# Altium schematic sheet Debugger.SchDoc: =DocumentName
size A4; Organization: Queen's Formula SAE; Address1: 130 Stuart St, Kingston; Address2: Ontario; Address3: Canada; Address4: K7L 2V9; DocumentNumber: 1; Revision: 0; SheetNumber: 1; SheetTotal: 1
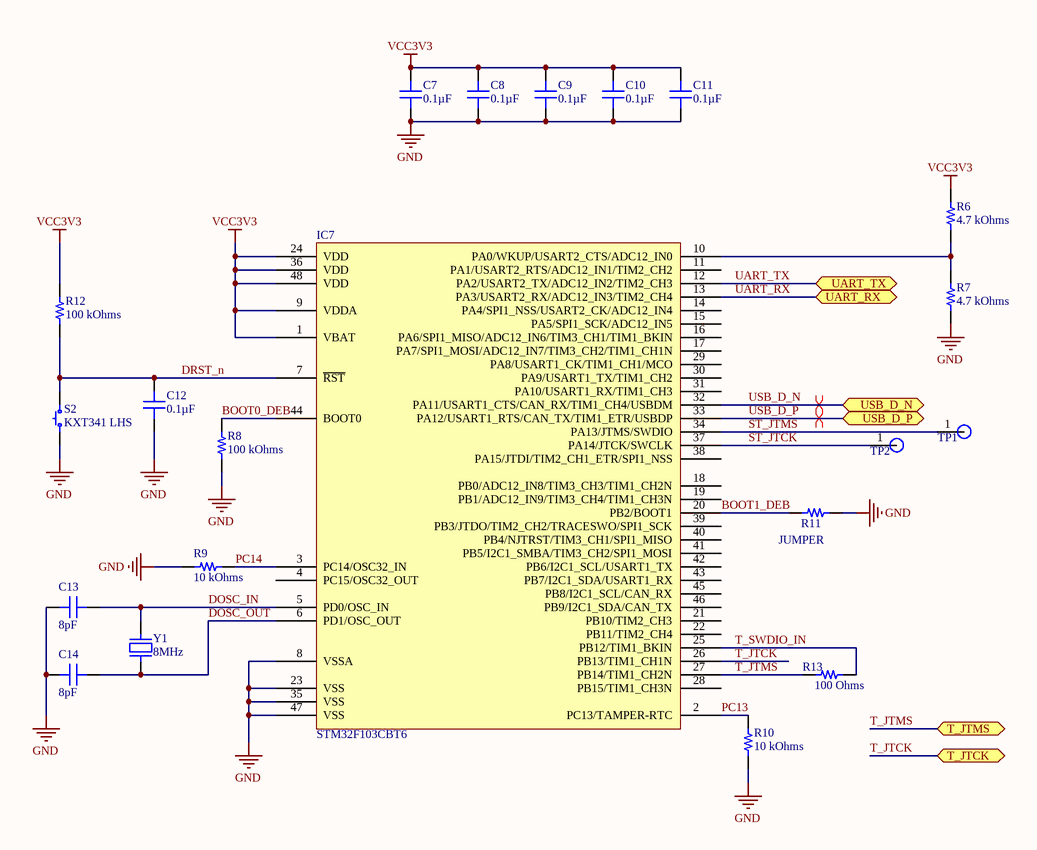
[diagram p0: Debugger.SchDoc]

## Parts
C7  0.1µF  [CAP 0201_0603]
C8  0.1µF  [CAP 0201_0603]
C9  0.1µF  [CAP 0201_0603]
C10  0.1µF  [CAP 0201_0603]
C11  0.1µF  [CAP 0201_0603]
C12  0.1µF  [CAP 0201_0603]
C13  8pF  [CAP 0402_1005]
C14  8pF  [CAP 0402_1005]
IC7  STM32F103CBT6  [ST LQFP-48 7X7MM]
R6  4.7 kOhms  [RES 0201_0603]
R7  4.7 kOhms  [RES 0201_0603]
R8  100 kOhms  [RES 0402_1005]
R9  10 kOhms  [RES 0201_0603]
R10  10 kOhms  [RES 0201_0603]
R11  JUMPER  [RES 0402_1005]
R12  100 kOhms  [RES 0201_0603]
R13  100 Ohms  [RES 0201_0603]
S2  KXT341 LHS  [C&K KXT3]
TP1  Test Point  [TP1]  (value not drawn)  (no BOM)
TP2  Test Point  [TP1]  (value not drawn)  (no BOM)
Y1  8MHz  [NDK NX3225GD]

## Ports
T_JTCK (bidir), T_JTMS (bidir), UART_RX (bidir), UART_TX (bidir), USB_D_N (bidir), USB_D_P (bidir)

## Nets
GND: C7.1 C8.1 C9.1 C10.1 C11.1 C12.1 C13.1 C14.1 IC7.8(VSSA) IC7.23(VSS) IC7.35(VSS) IC7.47(VSS) R7.1 R8.1 R9.2 R10.1 R11.1 S2.1
VCC3V3: C7.2 C8.2 C9.2 C10.2 C11.2 IC7.1(VBAT) IC7.9(VDDA) IC7.24(VDD) IC7.36(VDD) IC7.48(VDD) R6.2 R12.2
BOOT0_DEB: IC7.44(BOOT0) R8.2
BOOT1_DEB: IC7.20(PB2/BOOT1) R11.2
DOSC_IN: C13.2 IC7.5(PD0/OSC_IN) Y1.2
DOSC_OUT: C14.2 IC7.6(PD1/OSC_OUT) Y1.1
DRST_n: C12.2 IC7.7(~{RST}) R12.1 S2.2
PC13: IC7.2(PC13/TAMPER-RTC) R10.2
PC14: IC7.3(PC14/OSC32_IN) R9.1
ST_JTCK: IC7.37(PA14/JTCK/SWCLK) TP2.1
ST_JTMS: IC7.34(PA13/JTMS/SWDIO) TP1.1
T_JTCK: IC7.26(PB13/TIM1_CH1N) ; port T_JTCK
T_JTMS: IC7.27(PB14/TIM1_CH2N) R13.1 ; port T_JTMS
T_SWDIO_IN: IC7.25(PB12/TIM1_BKIN) R13.2
UART_RX: IC7.13(PA3/USART2_RX/ADC12_IN3/TIM2_CH4) ; port UART_RX
UART_TX: IC7.12(PA2/USART2_TX/ADC12_IN2/TIM2_CH3) ; port UART_TX
USB_D_N: IC7.32(PA11/USART1_CTS/CAN_RX/TIM1_CH4/USBDM) ; port USB_D_N
USB_D_P: IC7.33(PA12/USART1_RTS/CAN_TX/TIM1_ETR/USBDP) ; port USB_D_P
NetIC7_10: IC7.10(PA0/WKUP/USART2_CTS/ADC12_IN0) R6.1 R7.2

Not connected (* = marked no-connect by the designer): IC7 4(PC15/OSC32_OUT) 11(PA1/USART2_RTS/ADC12_IN1/TIM2_CH2) 14(PA4/SPI1_NSS/USART2_CK/ADC12_IN4) 15(PA5/SPI1_SCK/ADC12_IN5) 16(PA6/SPI1_MISO/ADC12_IN6/TIM3_CH1/TIM1_BKIN) 17(PA7/SPI1_MOSI/ADC12_IN7/TIM3_CH2/TIM1_CH1N) 18(PB0/ADC12_IN8/TIM3_CH3/TIM1_CH2N) 19(PB1/ADC12_IN9/TIM3_CH4/TIM1_CH3N) 21(PB10/TIM2_CH3) 22(PB11/TIM2_CH4) 28(PB15/TIM1_CH3N) 29(PA8/USART1_CK/TIM1_CH1/MCO) 30(PA9/USART1_TX/TIM1_CH2) 31(PA10/USART1_RX/TIM1_CH3) 38(PA15/JTDI/TIM2_CH1_ETR/SPI1_NSS) 39(PB3/JTDO/TIM2_CH2/TRACESWO/SPI1_SCK) 40(PB4/NJTRST/TIM3_CH1/SPI1_MISO) 41(PB5/I2C1_SMBA/TIM3_CH2/SPI1_MOSI) 42(PB6/I2C1_SCL/USART1_TX) 43(PB7/I2C1_SDA/USART1_RX) 45(PB8/I2C1_SCL/CAN_RX) 46(PB9/I2C1_SDA/CAN_TX)

## Layout directives
differential pair: USB_D_N, USB_D_P

## Notes on the sheet
- Title
- Size:
- Date:
- A4
- Number:
- Time:
- Revision:
- Sheet
- of
- File:

## Library data of the parts
C7-C12 = EMK063BJ104KP-F: CAP CER 0.1UF 16V X5R 0201; Manufacturer: Taiyo Yuden; Tolerance: ±10%; Part Number: EMK063BJ104KP-F; Value: 0.1µF; Applications: General Purpose; Capacitance: 0.1µF; ComponentLink1Description: Datasheet; ComponentLink1URL: https://ds.yuden.co.jp/TYCOMPAS/ut/detail?pn=EMK063BJ104KP-F  &u=M; ComponentLink2Description: DigiKey Link; ComponentLink2URL: http://digikey.com/product-detail/en/taiyo-yuden/EMK063BJ104KP-F/587-5833-1-ND/7674954; Device Package: 0201 (0603 Metric); LastUpdated: 2020-09-02 1:00:18 AM; Lifecycle Status: Active; Minimum Order: 1; Mounting Type: Surface Mount, MLCC; Operating Temperature: -55°C ~ 85°C; Package / Case: 0201 (0603 Metric); Packaging: TapeAndReel; PartId: 12; Part Status: Active; Price: 0.02; Series: M; Size / Dimension: 0.024" L x 0.012" W (0.60mm x 0.30mm); Supplier 1: DigiKey; Supplier Part Number 1: 587-5833-1-ND; Temperature Coefficient: X5R; Thickness (Max): 0.013" (0.33mm); Voltage - Rated: 16V
C13 C14 = C1005NP01H080D050BA: CAP CER 8PF 50V NP0 0402; Manufacturer: TDK Corporation; Temperature Coefficient: C0G, NP0; Tolerance: ±0.5pF; Part Number: C1005NP01H080D050BA; Value: 8pF; Applications: General Purpose; Capacitance: 8pF; ComponentLink1Description: Datasheet; ComponentLink1URL: https://product.tdk.com/info/en/catalog/datasheets/mlcc_commercial_hightemp_en.pdf?ref_disty=digikey; ComponentLink2Description: DigiKey Link; ComponentLink2URL: http://digikey.com/product-detail/en/tdk-corporation/C1005NP01H080D050BA/445-13781-1-ND/3955447; Device Package: 0402 (1005 Metric); Features: High Temperature; LastUpdated: 2020-09-02 1:02:24 AM; Lifecycle Status: Active; Minimum Order: 1; Mounting Type: Surface Mount, MLCC; Operating Temperature: -55°C ~ 150°C; Package / Case: 0402 (1005 Metric); Packaging: TapeAndReel; PartId: 2033; Part Status: Active; Price: 0.01; Series: C; Size / Dimension: 0.039" L x 0.020" W (1.00mm x 0.50mm); Supplier 1: DigiKey; Supplier Part Number 1: 445-13781-1-ND; Thickness (Max): 0.022" (0.55mm); Voltage - Rated: 50V
IC7 = STM32F103CBT6: IC MCU 32BIT 128KB FLASH 48LQFP; Manufacturer: STMicroelectronics; Connectivity: CANbus, I²C, IrDA, LINbus, SPI, UART/USART, USB; Core Processor: ARM® Cortex®-M3; Core Size: 32-Bit; Data Converters: A/D 10x12b; Number of I/O: 37; Oscillator Type: Internal; Peripherals: DMA, Motor Control PWM, PDR, POR, PVD, PWM, Temp Sensor, WDT; Program Memory Size: 128KB (128K x 8); RAM Size: 20K x 8; Speed: 72MHz; Voltage - Supply (Vcc/Vdd): 2V ~ 3.6V; Part Number: STM32F103CBT6; ComponentLink1Description: Datasheet; ComponentLink1URL: https://www.st.com/resource/en/datasheet/stm32f103cb.pdf; ComponentLink2Description: DigiKey Link; ComponentLink2URL: http://digikey.com/product-detail/en/stmicroelectronics/STM32F103CBT6/497-6288-ND/1754420; Device Package: 48-LQFP; LastUpdated: 2020-05-24 10:49:18 PM; Lifecycle Status: Active; Minimum Order: 1; Mounting Type: Surface Mount; Operating Temperature: -40°C ~ 85°C (TA); Package / Case: 48-LQFP; Packaging: Tray; PartId: 194; Part Status: Active; Price: 5.25; Program Memory Type: FLASH; Series: STM32F1; Supplier 1: DigiKey; Supplier Part Number 1: 497-6288-ND
R6 R7 = CRCW02014K70FKED: RES SMD 4.7K OHM 1% 1/20W 0201; Manufacturer: Vishay Dale; Power (Watts): 0.05W, 1/20W; Temperature Coefficient: ±100ppm/°C; Part Number: CRCW02014K70FKED; Value: 4.7 kOhms; ComponentLink1Description: Datasheet; ComponentLink1URL: http://www.vishay.com/docs/20052/crcw0201e3.pdf; ComponentLink2Description: DigiKey Link; ComponentLink2URL: http://digikey.com/product-detail/en/vishay-dale/CRCW02014K70FKED/541-4.70KAABCT-ND/1968253; Composition: Thick Film; Device Package: 0201 (0603 Metric); Height - Seated (Max): 0.011" (0.28mm); LastUpdated: 2020-09-02 1:06:25 AM; Lifecycle Status: Active; Minimum Order: 1; Number of Terminations: 2; Operating Temperature: -55°C ~ 155°C; Package / Case: 0201 (0603 Metric); Packaging: TapeAndReel; PartId: 37; Part Status: Active; Price: 0.03; Resistance: 4.7 kOhms; Series: CRCW; Size / Dimension: 0.024" L x 0.012" W (0.60mm x 0.30mm); Supplier 1: DigiKey; Supplier Part Number 1: 541-4.70KAABCT-ND; Supplier Device Package: 0201; Tolerance: ±1%
R8 = AC0402FR-07100KL: RES SMD 100K OHM 1% 1/16W 0402; Manufacturer: Yageo; Power (Watts): 0.063W, 1/16W; Temperature Coefficient: ±100ppm/°C; Part Number: AC0402FR-07100KL; Value: 100 kOhms; ComponentLink1Description: Datasheet; ComponentLink1URL: https://www.yageo.com/upload/media/product/productsearch/datasheet/rchip/PYu-AC_51_RoHS_L_7.pdf; ComponentLink2Description: DigiKey Link; ComponentLink2URL: http://digikey.com/product-detail/en/yageo/AC0402FR-07100KL/YAG3434CT-ND/6006283; Composition: Thick Film; Device Package: 0402 (1005 Metric); Features: Automotive AEC-Q200, Moisture Resistant; Height - Seated (Max): 0.015" (0.37mm); LastUpdated: 2020-09-02 1:07:50 AM; Lifecycle Status: Active; Minimum Order: 1; Number of Terminations: 2; Operating Temperature: -55°C ~ 155°C; Package / Case: 0402 (1005 Metric); Packaging: CutTape; PartId: 12047; Part Status: Active; Price: 0.10; Ratings: AEC-Q200; Resistance: 100 kOhms; Series: AC; Size / Dimension: 0.039" L x 0.020" W (1.00mm x 0.50mm); Supplier 1: DigiKey; Supplier Part Number 1: YAG3434CT-ND; Supplier Device Package: 0402; Tolerance: ±1%
R9 R10 = CRCW020110K0FKED: RES SMD 10K OHM 1% 1/20W 0201; Manufacturer: Vishay Dale; Power (Watts): 0.05W, 1/20W; Temperature Coefficient: ±100ppm/°C; Part Number: CRCW020110K0FKED; Value: 10 kOhms; ComponentLink1Description: Datasheet; ComponentLink1URL: http://www.vishay.com/docs/20052/crcw0201e3.pdf; ComponentLink2Description: DigiKey Link; ComponentLink2URL: http://digikey.com/product-detail/en/vishay-dale/CRCW020110K0FKED/541-10.0KAABCT-ND/1968173; Composition: Thick Film; Device Package: 0201 (0603 Metric); Height - Seated (Max): 0.011" (0.28mm); LastUpdated: 2020-09-02 1:06:25 AM; Lifecycle Status: Active; Minimum Order: 1; Number of Terminations: 2; Operating Temperature: -55°C ~ 155°C; Package / Case: 0201 (0603 Metric); Packaging: TapeAndReel; PartId: 29; Part Status: Active; Price: 0.03; Resistance: 10 kOhms; Series: CRCW; Size / Dimension: 0.024" L x 0.012" W (0.60mm x 0.30mm); Supplier 1: DigiKey; Supplier Part Number 1: 541-10.0KAABCT-ND; Supplier Device Package: 0201; Tolerance: ±1%
R11 = 5113: 0402 JUMPER ON TAPE AND REEL; Part Number: 5113; Manufacturer: Keystone Electronics; Power (Watts): 0.5W, 1/2W; ComponentLink1Description: Datasheet; ComponentLink1URL: http://www.keystoneelectronics.net/ENG._DEPT/WEB_ORACLE/PDF/PDF%20CAT%20NO%20DRAWINGS/5000-5999/5113.PDF; ComponentLink2Description: DigiKey Link; ComponentLink2URL: http://digikey.com/product-detail/en/keystone-electronics/5113/36-5113-1-ND/9921856; Composition: Metal Element; Device Package: 0402 (1005 Metric); Height - Seated (Max): 0.020" (0.50mm); LastUpdated: 2020-09-02 1:07:39 AM; Lifecycle Status: Active; Minimum Order: 1; Number of Terminations: 2; Package / Case: 0402 (1005 Metric); Packaging: TapeAndReel; PartId: 16398; Part Status: Active; Price: 0.16; Series: -; Size / Dimension: 0.039" L x 0.020" W (1.00mm x 0.50mm); Supplier 1: DigiKey; Supplier Part Number 1: 36-5113-1-ND; Supplier Device Package: 0402; Tolerance: Jumper
R12 = CRG0201F100K: RES SMD 100K OHM 1% 1/20W 0201; Manufacturer: TE Connectivity Passive Product; Power (Watts): 0.05W, 1/20W; Temperature Coefficient: ±200ppm/°C; Part Number: CRG0201F100K; Value: 100 kOhms; ComponentLink1Description: Datasheet; ComponentLink1URL: https://www.te.com/commerce/DocumentDelivery/DDEController?Action=srchrtrv&DocNm=1773204&DocType=DS&DocLang=English; ComponentLink2Description: DigiKey Link; ComponentLink2URL: http://digikey.com/product-detail/en/te-connectivity-passive-product/CRG0201F100K/A129572CT-ND/8566776; Composition: Thick Film; Device Package: 0201 (0603 Metric); Height - Seated (Max): 0.010" (0.26mm); LastUpdated: 2020-09-02 1:06:26 AM; Lifecycle Status: Active; Minimum Order: 1; Number of Terminations: 2; Operating Temperature: -55°C ~ 155°C; Package / Case: 0201 (0603 Metric); Packaging: TapeAndReel; PartId: 2; Part Status: Active; Price: 0.02; Resistance: 100 kOhms; Series: CRG, Neohm; Size / Dimension: 0.024" L x 0.012" W (0.60mm x 0.30mm); Supplier 1: DigiKey; Supplier Part Number 1: A129572CT-ND; Supplier Device Package: 0201; Tolerance: ±1%
R13 = CRCW0201100RFKED: RES SMD 100 OHM 1% 1/20W 0201; Manufacturer: Vishay Dale; Power (Watts): 0.05W, 1/20W; Temperature Coefficient: ±100ppm/°C; Part Number: CRCW0201100RFKED; Value: 100 Ohms; ComponentLink1Description: Datasheet; ComponentLink1URL: http://www.vishay.com/docs/20052/crcw0201e3.pdf; ComponentLink2Description: DigiKey Link; ComponentLink2URL: http://digikey.com/product-detail/en/vishay-dale/CRCW0201100RFKED/541-100AABCT-ND/1968157; Composition: Thick Film; Device Package: 0201 (0603 Metric); Height - Seated (Max): 0.011" (0.28mm); LastUpdated: 2020-09-02 1:06:25 AM; Lifecycle Status: Active; Minimum Order: 1; Number of Terminations: 2; Operating Temperature: -55°C ~ 155°C; Package / Case: 0201 (0603 Metric); Packaging: TapeAndReel; PartId: 33; Part Status: Active; Price: 0.03; Resistance: 100 Ohms; Series: CRCW; Size / Dimension: 0.024" L x 0.012" W (0.60mm x 0.30mm); Supplier 1: DigiKey; Supplier Part Number 1: 541-100AABCT-ND; Supplier Device Package: 0201; Tolerance: ±1%
S2 = KXT341 LHS: SWITCH TACTILE SPST-NO 0.02A 15V; Manufacturer: C&K; Actuator Height off PCB, Vertical: 0.60mm; Actuator Orientation: Top Actuated; Actuator Type: Standard; Contact Rating @ Voltage: 0.02A @ 15VDC; Illumination: Non-Illuminated; Operating Force: 330gf; Outline: 3.00mm x 2.00mm; Switch Function: Off-Mom; Part Number: KXT341 LHS; Circuit: SPST-NO; ComponentLink1Description: Datasheet; ComponentLink1URL: https://dznh3ojzb2azq.cloudfront.net/products/Tactile/KXT3/documents/datasheet.pdf; ComponentLink2Description: DigiKey Link; ComponentLink2URL: http://digikey.com/product-detail/en/c-k/KXT341-LHS/CKN10781CT-ND/6607324; LastUpdated: 2020-09-02 1:27:07 AM; Lifecycle Status: Active; Minimum Order: 1; Mounting Type: Surface Mount; Operating Temperature: -40°C ~ 85°C; Packaging: TapeAndReel; Part Status: Active; Price: 0.14; Series: KXT3; Supplier 1: DigiKey; Supplier Part Number 1: CKN10781CT-ND; Termination Style: SMD (SMT) Tab
TP1 TP2 = TP1
Y1 = NX3225GD-8MHZ-STD-CRA-3: CRYSTAL 8.0000MHZ 8PF SMD; Manufacturer: NDK America, Inc.; ESR (Equivalent Series Resistance): 500 Ohms; Frequency Stability: ±150ppm; Frequency Tolerance: ±50ppm; Operating Mode: Fundamental; Part Number: NX3225GD-8MHZ-STD-CRA-3; ComponentLink1Description: Datasheet; ComponentLink1URL: http://www.ndk.com/images/products/catalog/c_NX3225GD-STD-CRA-3_e.pdf; ComponentLink2Description: DigiKey Link; ComponentLink2URL: http://digikey.com/product-detail/en/ndk-america-inc/NX3225GD-8MHZ-STD-CRA-3/644-1178-1-ND/3125567; Frequency: 8MHz; Height - Seated (Max): 0.039" (1.00mm); LastUpdated: 2020-09-02 1:25:56 AM; Lifecycle Status: Active; Load Capacitance: 8pF; Minimum Order: 1; Mounting Type: Surface Mount; Operating Temperature: -40°C ~ 150°C; Package / Case: 2-SMD, No Lead; Packaging: TapeAndReel; PartId: 744; Part Status: Active; Price: 0.48; Ratings: AEC-Q200; Series: NX3225GD; Size / Dimension: 0.126" L x 0.098" W (3.20mm x 2.50mm); Supplier 1: DigiKey; Supplier Part Number 1: 644-1178-1-ND; Type: MHz Crystal; Value: 8MHz